# EAGLE design schematic (EAGLE 9.5.2)
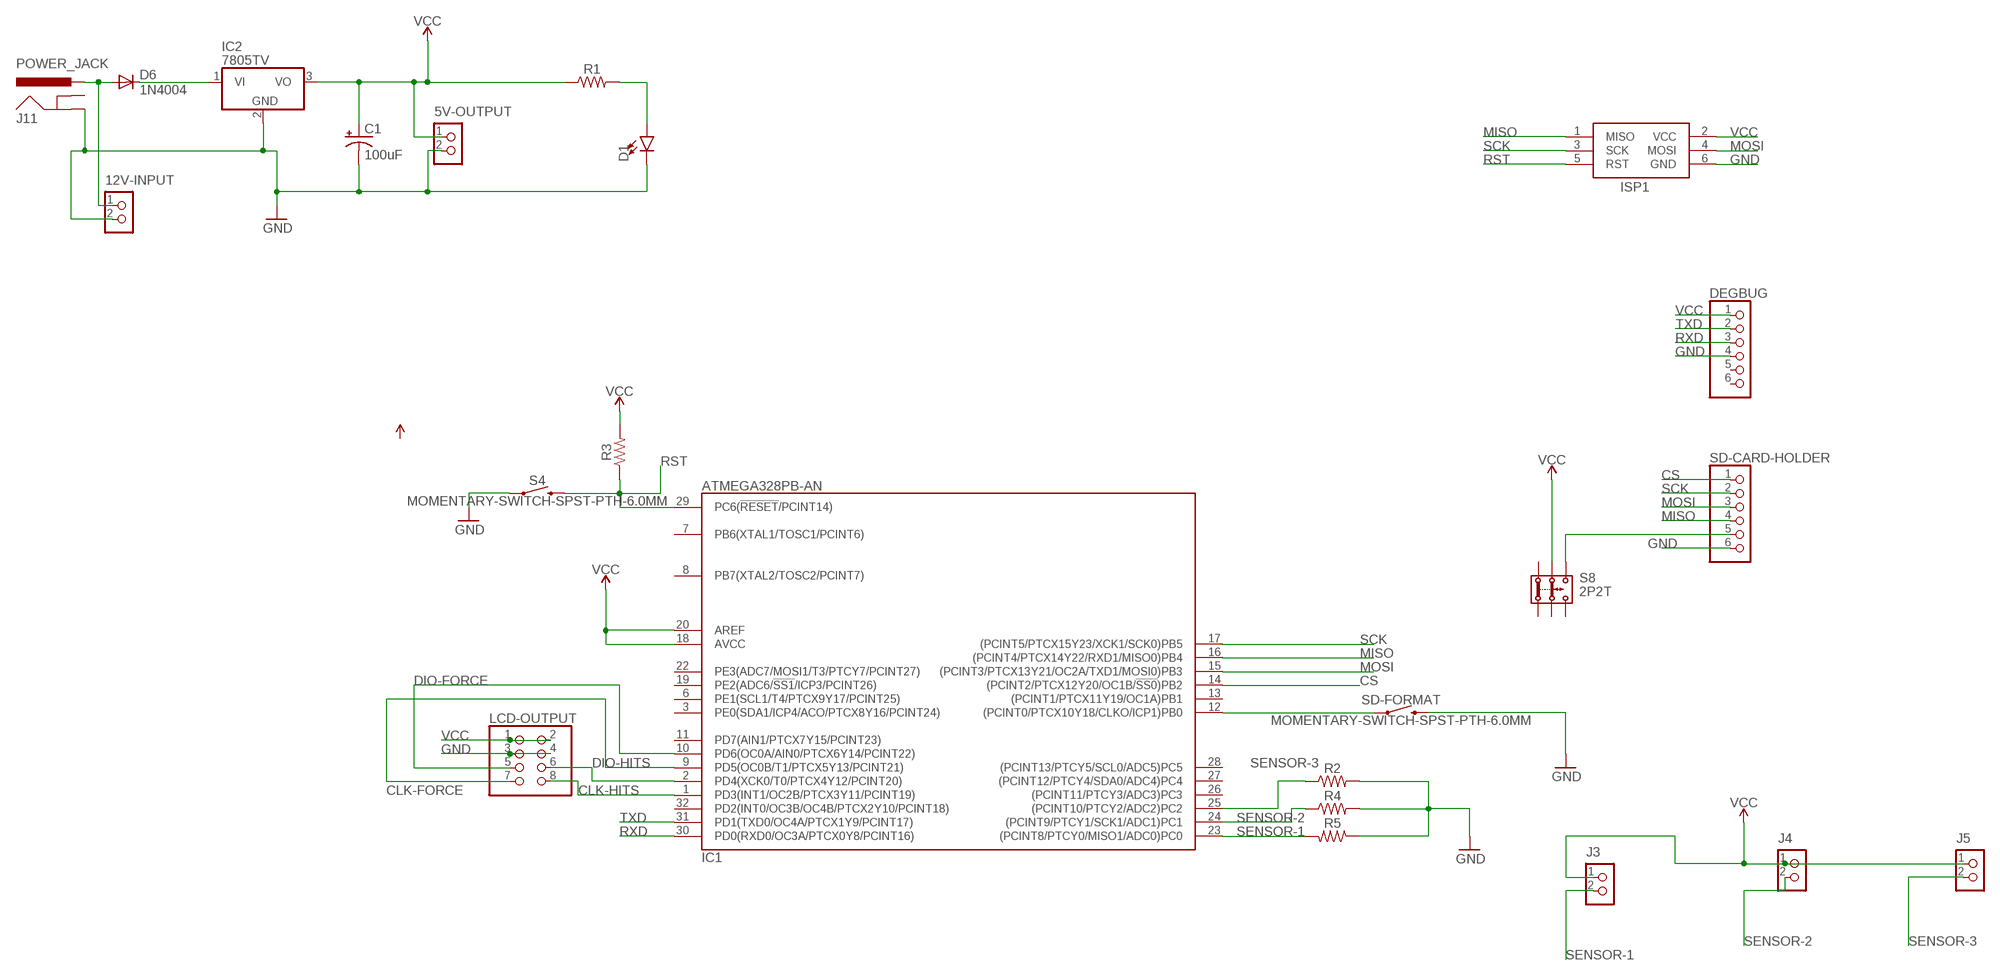
[diagram p0: schematic, sheet 1]

## Parts
5V-OUTPUT  CON_TERMINAL_BLOCK_02-5MM  [TERMINAL_BLOCK_2P_5]
12V-INPUT  CON_TERMINAL_BLOCK_02-5MM  [TERMINAL_BLOCK_2P_5]
C1  100uF  100UF-POLAR-RADIAL-2.5MM-25V-20%  [CPOL-RADIAL-2.5MM-6.5MM]
D1  LED1206  [LED-1206]
D6  1N4004  [DO41-10]
DEGBUG  PINHD-1X6  [1X06]
IC1  ATMEGA328PB-AN  [QFP32_7X7_0.80]
IC2  7805TV  [TO220V]
ISP1  AVRISP-6  [AVRISP]
J3  CON_TERMINAL_BLOCK_02-5MM  [TERMINAL_BLOCK_2P_5]
J4  CON_TERMINAL_BLOCK_02-5MM  [TERMINAL_BLOCK_2P_5]
J5  CON_TERMINAL_BLOCK_02-5MM  [TERMINAL_BLOCK_2P_5]
J11  POWER_JACK  [POWER_JACK_PTH]
LCD-OUTPUT  PINHD-2X4  [2X04]
R1  RESISTOR1206  [1206]
R2  RESISTOR1206  [1206]
R3  RESISTOR1206  [1206]
R4  RESISTOR1206  [1206]
R5  RESISTOR1206  [1206]
S4  MOMENTARY-SWITCH-SPST-PTH-6.0MM  [TACTILE_SWITCH_PTH_6.0MM]
S8  2P2T  [2P2T]
SD-CARD-HOLDER  PINHD-1X6  [1X06]
SD-FORMAT  MOMENTARY-SWITCH-SPST-PTH-6.0MM  [TACTILE_SWITCH_PTH_6.0MM]

## Nets
CLK-FORCE: IC1.9(PD5(OC0B/T1/PTCX5Y13/PCINT21)) LCD-OUTPUT.7
CLK-HITS: IC1.1(PD3(INT1/OC2B/PTCX3Y11/PCINT19)) LCD-OUTPUT.8
CS: IC1.14((PCINT2/PTCX12Y20/OC1B/!SS0!)PB2) SD-CARD-HOLDER.1
DIO-FORCE: IC1.10(PD6(OC0A/AIN0/PTCX6Y14/PCINT22)) LCD-OUTPUT.5
DIO-HITS: IC1.2(PD4(XCK0/T0/PTCX4Y12/PCINT20)) LCD-OUTPUT.6
GND: 5V-OUTPUT.2 12V-INPUT.2 C1.2(-) D1.C DEGBUG.4 IC2.2(GND) ISP1.6(GND) J11.GND LCD-OUTPUT.3 LCD-OUTPUT.4 R2.2 R4.2 R5.1 S4.1 SD-CARD-HOLDER.6 SD-FORMAT.3
MISO: IC1.16((PCINT4/PTCX14Y22/RXD1/MISO0)PB4) ISP1.1(MISO) SD-CARD-HOLDER.4
MOSI: IC1.15((PCINT3/PTCX13Y21/OC2A/TXD1/MOSI0)PB3) ISP1.4(MOSI) SD-CARD-HOLDER.3
N$1: D1.A R1.2
N$3: IC1.12((PCINT0/PTCX10Y18/CLKO/ICP1)PB0) SD-FORMAT.1
N$4: 12V-INPUT.1 D6.A J11.PWR
N$5: D6.C IC2.1(VI)
N$9: S8.3.1 SD-CARD-HOLDER.5
RST: IC1.29(PC6(!RESET!/PCINT14)) ISP1.5(RST) R3.1 S4.3
RXD: DEGBUG.3 IC1.30(PD0(RXD0/OC3A/PTCX0Y8/PCINT16))
SCK: IC1.17((PCINT5/PTCX15Y23/XCK1/SCK0)PB5) ISP1.3(SCK) SD-CARD-HOLDER.2
SENSOR-1: IC1.23((PCINT8/PTCY0/MISO1/ADC0)PC0) J3.2 R5.2
SENSOR-2: IC1.24((PCINT9/PTCY1/SCK1/ADC1)PC1) J4.2 R4.1
SENSOR-3: IC1.25((PCINT10/PTCY2/ADC2)PC2) J5.2 R2.1
TXD: DEGBUG.2 IC1.31(PD1(TXD0/OC4A/PTCX1Y9/PCINT17))
VCC: 5V-OUTPUT.1 C1.1(+) DEGBUG.1 IC1.18(AVCC) IC1.20(AREF) IC2.3(VO) ISP1.2(VCC) J3.1 J4.1 J5.1 LCD-OUTPUT.1 LCD-OUTPUT.2 R1.1 R3.2 S8.2.1
Unconnected: DEGBUG.5 DEGBUG.6 IC1.3(PE0(SDA1/ICP4/ACO/PTCX8Y16/PCINT24)) IC1.6(PE1(SCL1/T4/PTCX9Y17/PCINT25)) IC1.7(PB6(XTAL1/TOSC1/PCINT6)) IC1.8(PB7(XTAL2/TOSC2/PCINT7)) IC1.11(PD7(AIN1/PTCX7Y15/PCINT23)) IC1.13((PCINT1/PTCX11Y19/OC1A)PB1) IC1.19(PE2(ADC6/!SS1!/ICP3/PCINT26)) IC1.22(PE3(ADC7/MOSI1/T3/PTCY7/PCINT27)) IC1.26((PCINT11/PTCY3/ADC3)PC3) IC1.27((PCINT12/PTCY4/SDA0/ADC4)PC4) IC1.28((PCINT13/PTCY5/SCL0/ADC5)PC5) IC1.32(PD2(INT0/OC3B/OC4B/PTCX2Y10/PCINT18)) J11.GNDBREAK S8.1.1 S8.1.2 S8.2.2 S8.3.2

## Power pins joined to a net without a drawn wire
GND: IC1.5(GND) IC1.21(GND)
VCC: IC1.4(VCC)

## Library data of the parts
5V-OUTPUT 12V-INPUT J3-J5 = dp_devices.v6:CON_TERMINAL_BLOCK_02: 2 poles wire to board terminal block
C1 = SparkFun-Capacitors:100UF-POLAR: 100µF polarized capacitors A capacitor is a passive two-terminal electrical component used to store electrical energy temporarily in an electric field.; PROD_ID: CAP-08439
D1 = SparkFun-LED:LED: LED (Generic) Standard schematic elements and footprints for 5mm, 3mm, 1206, and 0603 sized LEDs. Generic LEDs with no color specified.
D6 = adafruit:1N4004: DIODE General purpose 1N400x type rectifier (With bigger pads) http://www.ladyada.net/library/pcb/eaglelibrary.html
DEGBUG SD-CARD-HOLDER = adafruit:PINHD-1X6: PIN HEADER
IC1 = atmel:ATMEGA328PB: 8-bit AVR Microcontroller 32kbytes flash 2kbytes SRAM 1kbyte EEPROM USART 8-channel 10 bit ADC
IC2 = linear:78*: Positive VOLTAGE REGULATOR Source: http://cache.national.com/ds/LM/LM78L05.pdf http://www.fairchildsemi.com/ds/LM/LM7805.pdf
ISP1 = adafruit:AVRISP: AVR ISP HEADER Standard 6 pin header for AVR programming
J11 = SparkFun-Connectors:POWER_JACK: Power Jack Connector This is the standard 5.5mm barrel jack for power. The PTH is the most common, proven, reliable, footprint. The Slot footprint only works if the mill layer is transmitted to the PCB fab house so be warned. Here are the connectors we sell at SparkFun: DC Barrel Power Jack/Connector <https://www.sparkfun.com/products/119> (PRT-00119) DC Barrel Power Jack/Connector (SMD) <https://www.sparkfun.com/products/12748> (PRT-12748) DC Barrel Jack Adapter - Breadboard Compatible <https://www.sparkfun.com/products/10811> (PRT-10811) It is used on this SparkFun product (and many, many others): SparkFun RedBoard - Programmed with Arduino <https://www.sparkfun.com/products/12757> (DEV-12757) Also, if you need a mating power supply or connector, please check these out: Wall Adapter Power Supply - 9VDC 650mA <https://www.sparkfun.com/products/298> (TOL-00298) DC Barrel Jack Adapter - Male <https://www.sparkfun.com/products/10287> (PRT-10287); PROD_ID: CONN-08197
LCD-OUTPUT = adafruit:PINHD-2X4: PIN HEADER
R1-R5 = SparkFun-Resistors:RESISTOR: Generic Resistor Package
S4 SD-FORMAT = SparkFun-Switches:MOMENTARY-SWITCH-SPST: Momentary Switch (Pushbutton) - SPST Normally-open (NO) SPST momentary switches (buttons, pushbuttons). Variants PTH-12MM - 12mm square, through-hole Momentary Pushbutton Switch - 12mm Square <https://www.sparkfun.com/products/9190> (COM-09190) PTH-6.0MM, PTH-6.0MM-KIT - 6.0mm square, through-hole Mini Pushbutton Switch <https://www.sparkfun.com/products/97> (COM-00097) KIT package intended for soldering kit's - only one side of pads' copper is exposed. PTH-RIGHT-ANGLE-KIT - Right-angle, through-hole Right Angle Tactile Button <https://www.sparkfun.com/products/10791> - Used on SparkFun BigTime Watch Kit <https://www.sparkfun.com/products/11734> SMD-12MM - 12mm square, surface-mount Tactile Button - SMD (12mm) <https://www.sparkfun.com/products/12993> (COM-12993) Used on SparkFun PicoBoard <https://www.sparkfun.com/products/11888> SMD-4.5MM - 4.5mm Square Trackball Switch Used on SparkFun Blackberry Trackballer Breakout <https://www.sparkfun.com/products/13169> SMD-4.6MMX2.8MM - 4.60mm x 2.80mm, surface mount Used on SparkFun SAMD21 Mini Breakout <https://www.sparkfun.com/products/13664> SMD-5.2MM, SMD-5.2-REDUNDANT - 5.2mm square, surface-mount Mini Pushbutton Switch - SMD <https://www.sparkfun.com/products/8720> (COM-08720) Used on Arduino Pro Mini <https://www.sparkfun.com/products/11114> REDUNDANT package connects both switch circuits together SMD-6.0X3.5MM - 6.0 x 3.5mm, surface mount Momentary Reset Switch SMD <https://www.sparkfun.com/products/8229> (COM-08229) SMD-6.2MM-TALL - 6.2mm square, surface mount Tactile Button - SMD (6mm) <https://www.sparkfun.com/products/12992> Used on SparkFun Digital Sandbox <https://www.sparkfun.com/products/12651> SMD-RIGHT-ANGLE - Right-angle, surface mount Used on SparkFun Block for Intel® Edison - Arduino <https://www.sparkfun.com/products/13036>; PROD_ID: SWCH-08441; SF_SKU: COM-00097
S8 = switch:2P2T: SLIDE SWITCH 2P2T Part No. SS-22F05-G(A)4 Source: CANAL ELECTRONIC CO., LTD .. switsch.pdf

## Board
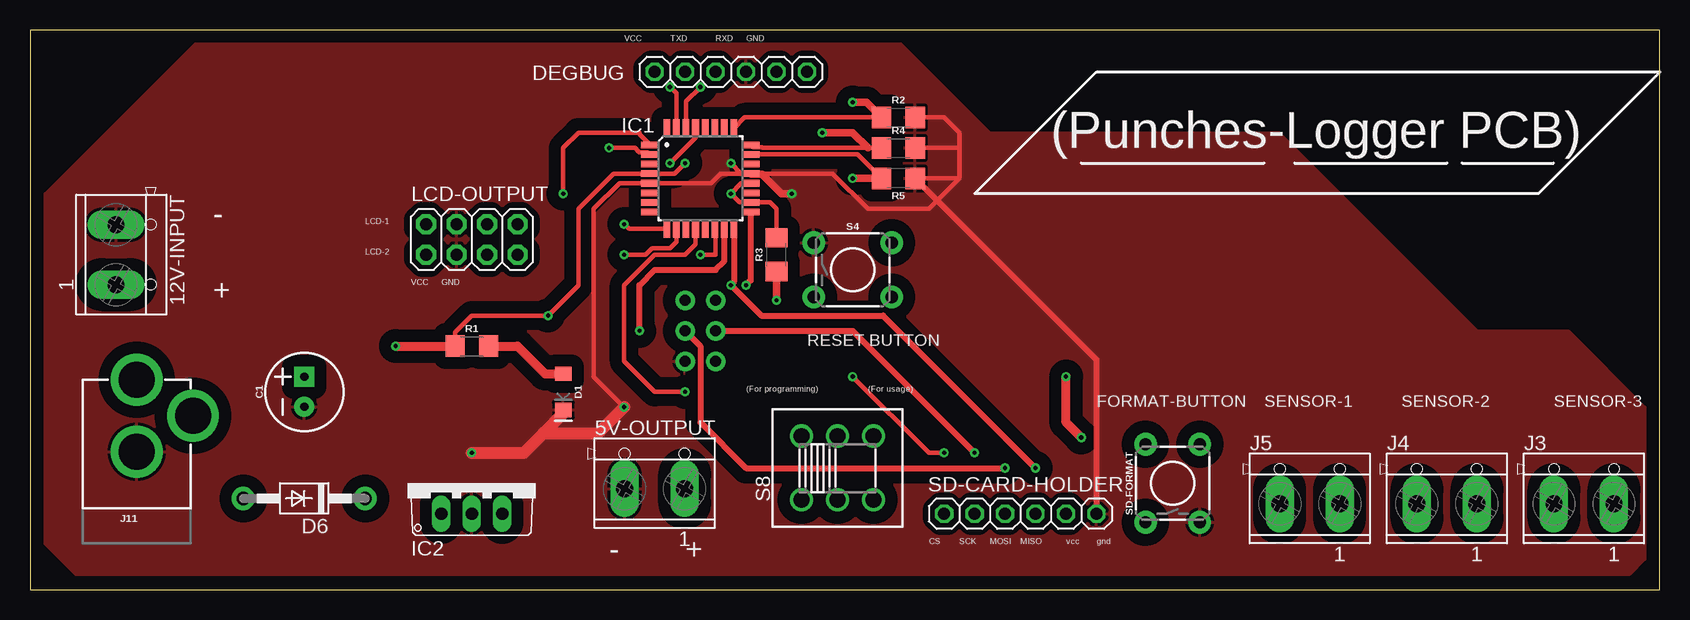
[diagram p1: board, top side]
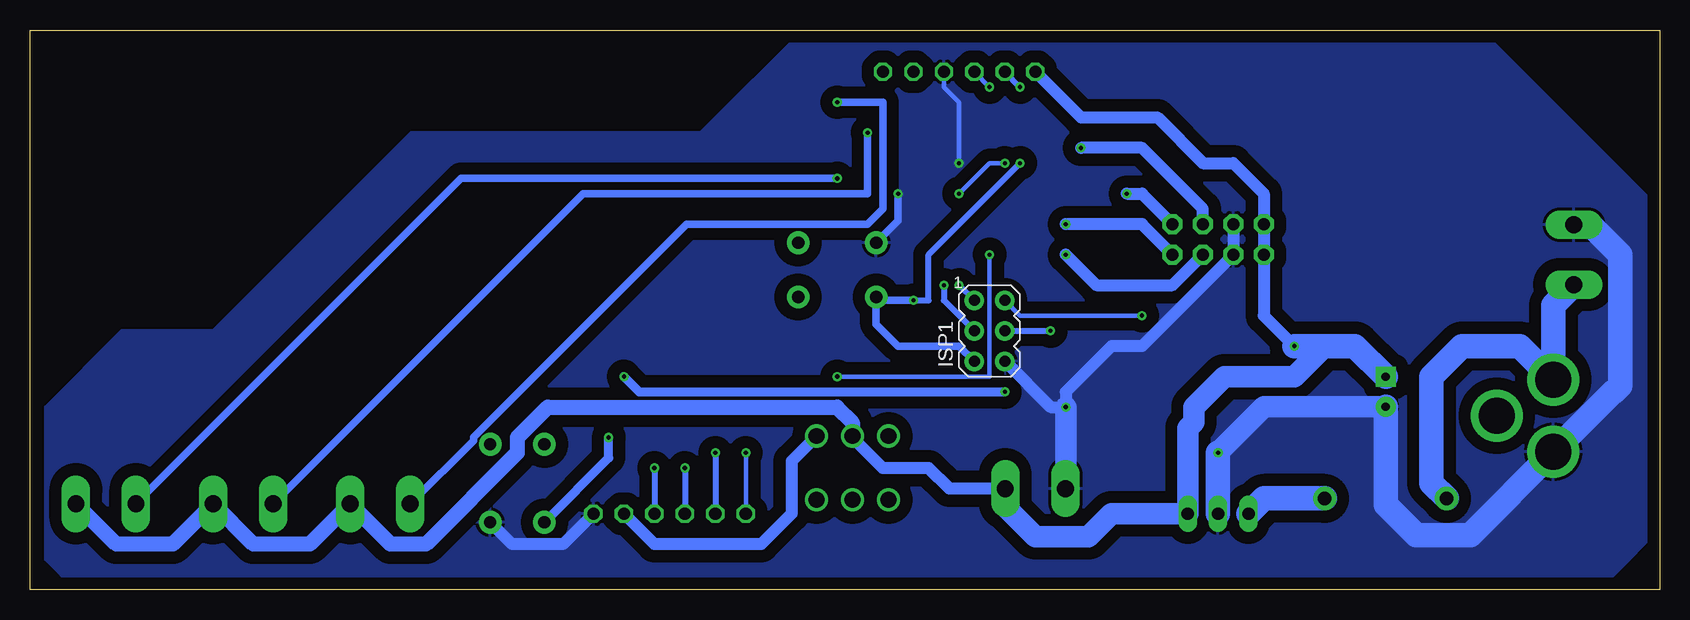
[diagram p2: board, bottom side, seen from below]

Size 135.87 x 46.66 mm. Coordinates in mm from the lower left corner, seen from the top.
Outline: 0,0 135.87,0 135.87,46.66 0,46.66 0,0
Copper layers (1*16): Top 0.035mm / dielectric 1.5mm / Bottom 0.035mm
Design rules "default": minimum track width 6mil, minimum drill 0.35mm, track to track 6mil, track to pad 6mil, pad to pad 6mil, via to via 6mil, smd to smd 6mil, copper to edge 40mil, drill to drill 6mil, minimum pad ring 10mil, minimum via ring 8mil, stop-mask expansion 4mil, vias tented up to drill 0mil, thermal gap 10mil

### Footprints (pad centres in the part's own frame; a part is rotated, then mirrored left to right if it is on the bottom)
TERMINAL_BLOCK_2P_5 = drill 1.4 pad 2.38 long: 1 2.5,-0.45; 2 -2.5,-0.45
CPOL-RADIAL-2.5MM-6.5MM = drill 0.7 pad 1.651 square: 1 1.25,0 | drill 0.7 pad 1.651: 2 -1.25,0
LED-1206 = smd 1.2 x 1.4: A -1.5,0; C 1.5,0
DO41-10 = drill 1.118 pad 1.93: A 5.08,0; C -5.08,0
1X06 = drill 1.016 octagon: 1 -6.35,0; 2 -3.81,0; 3 -1.27,0; 4 1.27,0; 5 3.81,0; 6 6.35,0
QFP32_7X7_0.80 = smd 1.5 x 0.55: 1 -4.2,2.8; 2 -4.2,2; 3 -4.2,1.2; 4 -4.2,0.4; 5 -4.2,-0.4; 6 -4.2,-1.2; 7 -4.2,-2; 8 -4.2,-2.8; 17 4.2,-2.8; 18 4.2,-2; 19 4.2,-1.2; 20 4.2,-0.4; 21 4.2,0.4; 22 4.2,1.2; 23 4.2,2; 24 4.2,2.8 | smd 0.55 x 1.5: 9 -2.8,-4.2; 10 -2,-4.2; 11 -1.2,-4.2; 12 -0.4,-4.2; 13 0.4,-4.2; 14 1.2,-4.2; 15 2,-4.2; 16 2.8,-4.2; 25 2.8,4.2; 26 2,4.2; 27 1.2,4.2; 28 0.4,4.2; 29 -0.4,4.2; 30 -1.2,4.2; 31 -2,4.2; 32 -2.8,4.2
TO220V = drill 1.016 long: 1 -2.54,-2.54; 2 0,-2.54; 3 2.54,-2.54
AVRISP = drill 0.9 pad 1.626: 1 -1.27,2.54; 2 1.27,2.54; 3 -1.27,0; 4 1.27,0; 5 -1.27,-2.54; 6 1.27,-2.54
POWER_JACK_PTH = drill 2.997 pad 4.318: GND 0,7.7; GNDBREAK 4.7,10.7; PWR 0,13.7
2X04 = drill 1.016 pad 1.676 octagon: 1 -3.81,-1.27; 2 -3.81,1.27; 3 -1.27,-1.27; 4 -1.27,1.27; 5 1.27,-1.27; 6 1.27,1.27; 7 3.81,-1.27; 8 3.81,1.27
1206 = smd 1.6 x 1.8: 1 -1.4,0; 2 1.4,0
TACTILE_SWITCH_PTH_6.0MM = drill 1.016 pad 1.88: 1 -3.251,2.261; 2 3.251,2.261; 3 -3.251,-2.261; 4 3.251,-2.261
2P2T = drill 1.3 pad 1.93: 1.1 -3,2.65; 1.2 -3,-2.65; 2.1 0,2.65; 2.2 0,-2.65; 3.1 3,2.65; 3.2 3,-2.65

### Placement (x,y rotation side)
5V-OUTPUT  52.07,8.89 0 top
12V-INPUT  7.62,27.94 270 top
C1  22.86,16.51 90 top
D1  44.45,16.51 270 top
D6  22.86,7.62 180 top
DEGBUG  58.42,43.18 0 top
IC1  55.88,34.29 0 top
IC2  36.83,8.89 0 top
ISP1  55.88,21.59 0 bottom
J3  129.54,7.62 0 top
J4  118.11,7.62 0 top
J5  106.68,7.62 0 top
J11  8.89,3.81 0 top
LCD-OUTPUT  36.83,29.21 0 top
R1  36.83,20.32 0 top
R2  72.39,39.37 0 top
R3  62.23,27.94 90 top
R4  72.39,36.83 0 top
R5  72.39,34.29 180 top
S4  68.58,26.67 0 top
S8  67.31,10.16 0 top
SD-CARD-HOLDER  82.55,6.35 0 top
SD-FORMAT  95.25,8.89 90 top

### Tracks (layer width: path | path; a pad name or v marks a point on that pad's centre or on a via)
CLK-FORCE  (via drill 0.35)
  Top 0.381: v49.53,30.48 49.92,30.09 IC1.9
  Bottom 1.016: LCD-OUTPUT.7 43.18,30.48 v49.53,30.48
CLK-HITS  (via drill 0.35)
  Top 0.381: IC1.1 50.8,37.97 50.8,38.1 45.72,38.1 44.45,36.83 v44.45,33.02
  Bottom 1.016: v44.45,33.02 43.18,33.02 LCD-OUTPUT.8
CS  (via drill 0.35)
  Top 0.381: IC1.14 57.15,30.02 57.15,27.94 v55.88,27.94 | v68.58,17.78 74.93,11.43 v76.2,11.43
  Bottom 0.381: v55.88,27.94 55.88,17.78 v68.58,17.78 | v76.2,11.43 SD-CARD-HOLDER.1
DIO-FORCE  (via drill 0.35)
  Top 0.381: IC1.10 53.88,29.01 53.34,28.47 51.85,28.47 51.32,27.94 v49.53,27.94
  Bottom 1.016: v49.53,27.94 46.99,25.4 40.64,25.4 LCD-OUTPUT.5
DIO-HITS  (via drill 0.35)
  Top 0.381: IC1.2 51.5,36.47 50.79,36.47 50.43,36.83 v48.26,36.83
  Bottom 1.016: LCD-OUTPUT.6 38.1,31.75 43.18,36.83 v48.26,36.83
GND  (via drill 0.35)
  Top 0.381: v49.53,15.24 46.99,17.78 46.99,31.75 49.13,33.89 IC1.5 56.75,33.89 57.55,34.69 IC1.21 | R2.2 76.2,39.37 77.47,38.1 77.47,36.83 | 77.47,36.83 R4.2 | 77.47,36.83 77.47,34.29 | R5.1 77.47,34.29 | 77.47,34.29 74.93,31.75 69.85,31.75 66.91,34.69 IC1.21 | v58.42,35.56 59.29,34.69 IC1.21
  Top 0.508: R5.1 88.9,19.18 SD-CARD-HOLDER.6
  Top 0.635: IC1.21 60.14,34.63 61.03,34.63 62.64,33.02 v63.5,33.02
  Top 1.016: 42.81,13.07 47.36,13.07 v49.53,15.24 | 42.81,13.07 41.17,11.43 v36.83,11.43 | D1.C 44.45,14.71 42.81,13.07
  Bottom 0.381: DEGBUG.4 59.69,41.91 58.42,40.64 v58.42,35.56
  Bottom 0.635: S4.1 63.5,30.76 v63.5,33.02
  Bottom 1.016: ISP1.6 50.8,15.24 v49.53,15.24 49.53,16.51 45.72,20.32 43.18,20.32 LCD-OUTPUT.3 LCD-OUTPUT.4 | SD-CARD-HOLDER.6 91.44,3.81 95.68,3.81 SD-FORMAT.3
  Bottom 1.778: C1.2 33,15.26 v36.83,11.43 | 5V-OUTPUT.2 49.53,8.48 v49.53,15.24
  Bottom 2.032: 12V-INPUT.2 5.8,30.44 3.3,27.94 3.3,17.02 3.81,16.51 3.89,16.51 J11.GND 15.83,4.57 20.32,4.57 22.86,7.11 C1.2 | v36.83,11.43 IC2.2
  pour Bottom (isolate 1.016): 3.81,35.56 15.24,46.99 71.12,46.99 80.01,38.1 104.14,38.1 120.65,21.59 128.27,21.59 134.62,15.24 134.62,2.54 132.08,0 5.08,0 3.81,1.27 0,5.08 0,7.62 0,31.75
  pour Top (isolate 1.016): 1.27,33.02 13.97,45.72 72.39,45.72 80.01,38.1 104.14,38.1 120.65,21.59 128.27,21.59 134.62,15.24 134.62,2.54 133.35,1.27 3.81,1.27 1.27,3.81
MISO  (via drill 0.35)
  Top 0.508: IC1.16 58.68,25.66 v58.42,25.4 60.96,22.86 71.12,22.86 v83.82,10.16
  Bottom 0.508: v58.42,25.4 ISP1.1 | v83.82,10.16 SD-CARD-HOLDER.4
MOSI  (via drill 0.35)
  Top 0.508: v50.8,21.59 50.8,25.4 52.07,26.67 57.15,26.67 57.88,27.4 IC1.15 | ISP1.4 55.88,20.32 55.88,13.97 59.69,10.16 v81.28,10.16
  Bottom 0.508: ISP1.4 v50.8,21.59 | v81.28,10.16 SD-CARD-HOLDER.3
N$1
  Top 0.762: R1.2 40.64,20.32 42.95,18.01 D1.A
N$3  (via drill 0.35)
  Top 0.381: v54.61,16.51 52.07,16.51 49.53,19.05 49.53,25.4 52.07,27.94 54.61,27.94 55.48,28.81 IC1.12
  Top 0.762: v87.63,12.7 86.36,13.97 v86.36,17.78
  Bottom 0.762: SD-FORMAT.1 87.63,11 v87.63,12.7 | v86.36,17.78 85.09,16.51 v54.61,16.51
N$4
  Bottom 2.032: 12V-INPUT.1 8.89,23.72 J11.PWR 11.7,20.32 16.51,20.32 19.05,17.78 19.05,8.89 D6.A
N$5
  Bottom 2.032: D6.C 33.02,7.62 IC2.1
N$9
  Bottom 1.016: S8.3.1 72.39,10.73 72.39,6.35 74.93,3.81 83.82,3.81 SD-CARD-HOLDER.5
RST  (via drill 0.35)
  Top 0.381: IC1.29 55.48,37.7 v53.34,35.56
  Top 0.635: v62.23,24.13 R3.1
  Bottom 0.508: v62.23,24.13 60.96,24.13 60.96,27.94 v53.34,35.56
  Bottom 0.635: v62.23,24.13 65.05,24.13 S4.3 65.33,22.15 63.5,20.32 58.42,20.32 ISP1.5
RXD  (via drill 0.35)
  Top 0.381: IC1.30 54.68,40.71 v55.88,41.91
  Bottom 0.381: v55.88,41.91 DEGBUG.3
SCK  (via drill 0.35)
  Top 0.508: IC1.17 60.08,25.79 v59.69,25.4 | v78.74,11.43 68.58,21.59 ISP1.3
  Bottom 0.508: v59.69,25.4 59.69,24.13 ISP1.3 | v78.74,11.43 SD-CARD-HOLDER.2
SENSOR-1  (via drill 0.35)
  Top 0.381: IC1.23 68.99,36.29 R5.2
  Top 0.61: v68.58,34.29 R5.2
  Bottom 0.61: J3.2 99.92,34.29 v68.58,34.29
SENSOR-2  (via drill 0.35)
  Top 0.381: R4.1 69.85,36.83 61.05,36.83 60.97,36.91 60.26,36.91 IC1.24
  Top 0.61: v66.04,38.1 68.58,38.1 69.85,36.83
  Bottom 0.61: J4.2 89.76,33.02 66.04,33.02 v66.04,38.1
SENSOR-3  (via drill 0.35)
  Top 0.381: R2.1 59.56,39.37 IC1.25
  Top 0.61: v68.58,40.64 69.72,40.64 R2.1
  Bottom 0.61: J5.2 98.91,12.44 98.91,12.72 81.15,30.48 66.04,30.48 64.77,31.75 64.77,40.64 v68.58,40.64
TXD  (via drill 0.35)
  Top 0.381: IC1.31 53.88,41.37 v53.34,41.91
  Bottom 0.508: DEGBUG.2 v53.34,41.91
VCC  (via drill 0.35)
  Top 0.381: IC1.20 59.29,33.89 v58.42,33.02 59.15,32.29 IC1.18 61.69,32.29 62.23,31.75 R3.2 | v54.61,35.56 53.74,34.69 IC1.4 48.66,34.69 45.72,31.75 45.72,25.4 v43.18,22.86 36.83,22.86 35.43,21.46 R1.1
  Top 0.762: v30.48,20.32 R1.1
  Bottom 0.381: v54.61,35.56 55.88,35.56 v58.42,33.02 | ISP1.2 53.34,22.86 v43.18,22.86
  Bottom 1.016: 5V-OUTPUT.1 59.24,8.44 60.96,10.16 64.77,10.16 67.31,12.7 S8.2.1 | v30.48,20.32 33.02,22.86 LCD-OUTPUT.1 LCD-OUTPUT.2 33.02,33.02 35.56,35.56 38.1,35.56 41.91,39.37 48.26,39.37 DEGBUG.1
  Bottom 1.27: J3.1 128.68,3.81 123.97,3.81 J4.1 117.25,3.81 112.54,3.81 J5.1 105.82,3.81 102.87,3.81 95.25,11.43 95.25,12.7 92.71,15.24 68.58,15.24 67.31,13.97 67.31,12.7
  Bottom 1.778: 5V-OUTPUT.1 54.57,6.95 52.07,4.45 47.62,4.45 45.72,6.35 IC2.3 39.37,13.46 38.86,13.98 38.86,15.24 36.32,17.78 30.48,17.78 27.94,20.32
  Bottom 2.032: C1.1 25.42,20.32 27.94,20.32 v30.48,20.32

### Text on the board
tPlace: VCC | TXD | RXD | GND | (Punches-Logger PCB) | - | LCD-1 | LCD-2 | VCC | GND | + | RESET BUTTON | (For programming) | (For usage) | FORMAT-BUTTON | SENSOR-1 | SENSOR-2 | SENSOR-3 | CS | SCK | MOSI | MISO | vcc | gnd | - | +